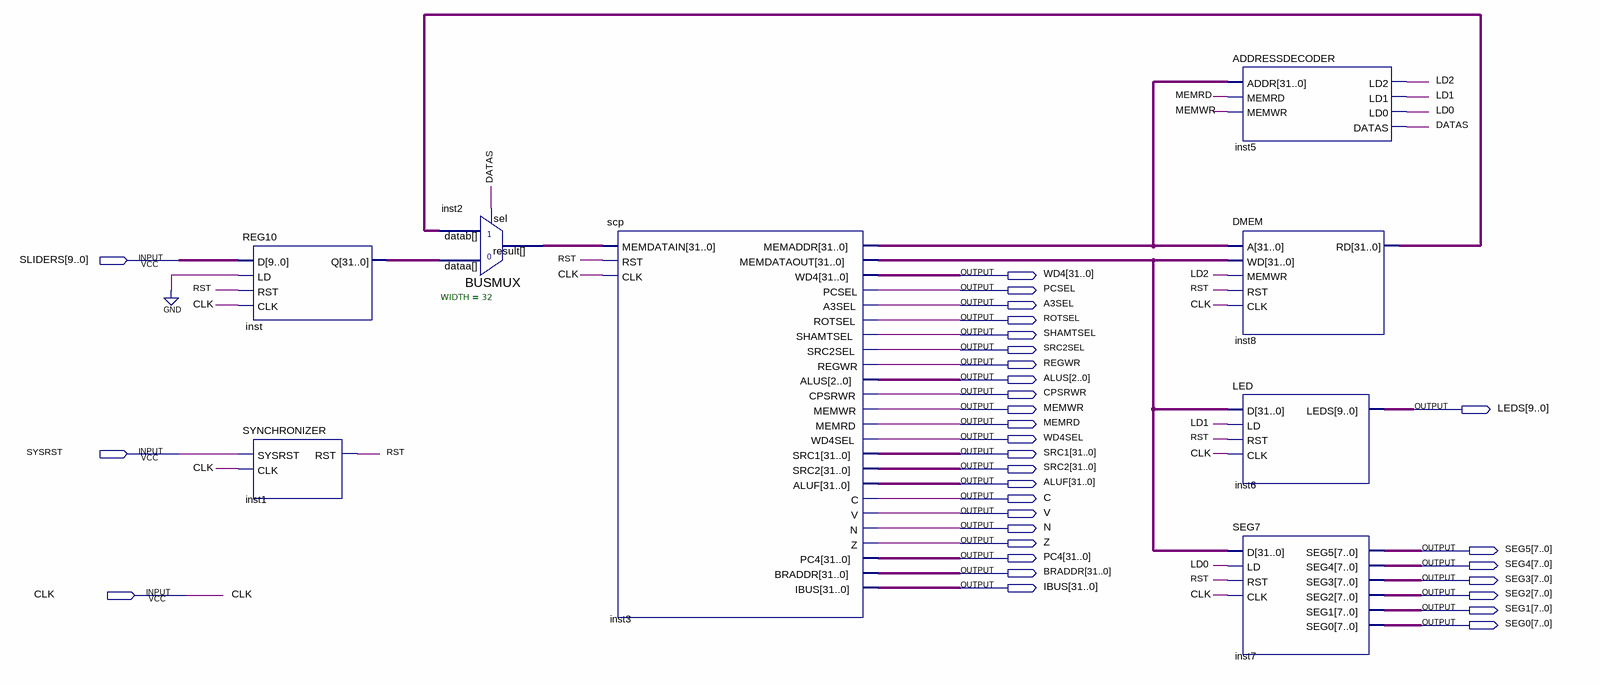
[diagram p0: schematic sheet]
// Quartus schematic system.bdf as structural Verilog: 8 symbols, 32 pins
module system (
  input  [9:0] SLIDERS,
  input  SYSRST,
  input  CLK,
  output [31:0] WD4,
  output PCSEL,
  output A3SEL,
  output ROTSEL,
  output SHAMTSEL,
  output SRC2SEL,
  output REGWR,
  output [2:0] ALUS,
  output CPSRWR,
  output MEMWR,
  output [9:0] LEDS,
  output MEMRD,
  output WD4SEL,
  output [31:0] SRC1,
  output [31:0] SRC2,
  output [31:0] ALUF,
  output C,
  output V,
  output N,
  output Z,
  output [7:0] SEG5,
  output [31:0] PC4,
  output [7:0] SEG4,
  output [31:0] BRADDR,
  output [7:0] SEG3,
  output [31:0] IBUS,
  output [7:0] SEG2,
  output [7:0] SEG1,
  output [7:0] SEG0
);

  wire DATAS, LD0, LD1, LD2, RST;
  wire [31:0] inst2_result, inst3_memaddr, inst3_memdataout, inst8_rd, inst_q;

  REG10 inst (.D(SLIDERS), .LD(1'b0), .RST(RST), .CLK(CLK), .Q(inst_q));
  SYNCHRONIZER inst1 (.SYSRST(SYSRST), .CLK(CLK), .RST(RST));
  BUSMUX #(.WIDTH(32)) inst2 (.datab(inst8_rd), .sel(DATAS), .dataa(inst_q), .result(inst2_result));
  scp inst3 (
    .MEMDATAIN(inst2_result), .RST(RST), .CLK(CLK), .MEMADDR(inst3_memaddr), .MEMDATAOUT(inst3_memdataout),
    .WD4(WD4), .PCSEL(PCSEL), .A3SEL(A3SEL), .ROTSEL(ROTSEL), .SHAMTSEL(SHAMTSEL), .SRC2SEL(SRC2SEL),
    .REGWR(REGWR), .ALUS(ALUS), .CPSRWR(CPSRWR), .MEMWR(MEMWR), .MEMRD(MEMRD), .WD4SEL(WD4SEL), .SRC1(SRC1),
    .SRC2(SRC2), .ALUF(ALUF), .C(C), .V(V), .N(N), .Z(Z), .PC4(PC4), .BRADDR(BRADDR), .IBUS(IBUS));
  ADDRESSDECODER inst5 (
    .ADDR(inst3_memaddr), .MEMRD(MEMRD), .MEMWR(MEMWR), .LD2(LD2), .LD1(LD1), .LD0(LD0), .DATAS(DATAS));
  DMEM inst8 (.A(inst3_memaddr), .WD(inst3_memdataout), .MEMWR(LD2), .RST(RST), .CLK(CLK), .RD(inst8_rd));
  LED inst6 (.D(inst3_memdataout), .LD(LD1), .RST(RST), .CLK(CLK), .LEDS(LEDS));
  SEG7 inst7 (
    .D(inst3_memdataout), .LD(LD0), .RST(RST), .CLK(CLK), .SEG5(SEG5), .SEG4(SEG4), .SEG3(SEG3), .SEG2(SEG2),
    .SEG1(SEG1), .SEG0(SEG0));
endmodule
